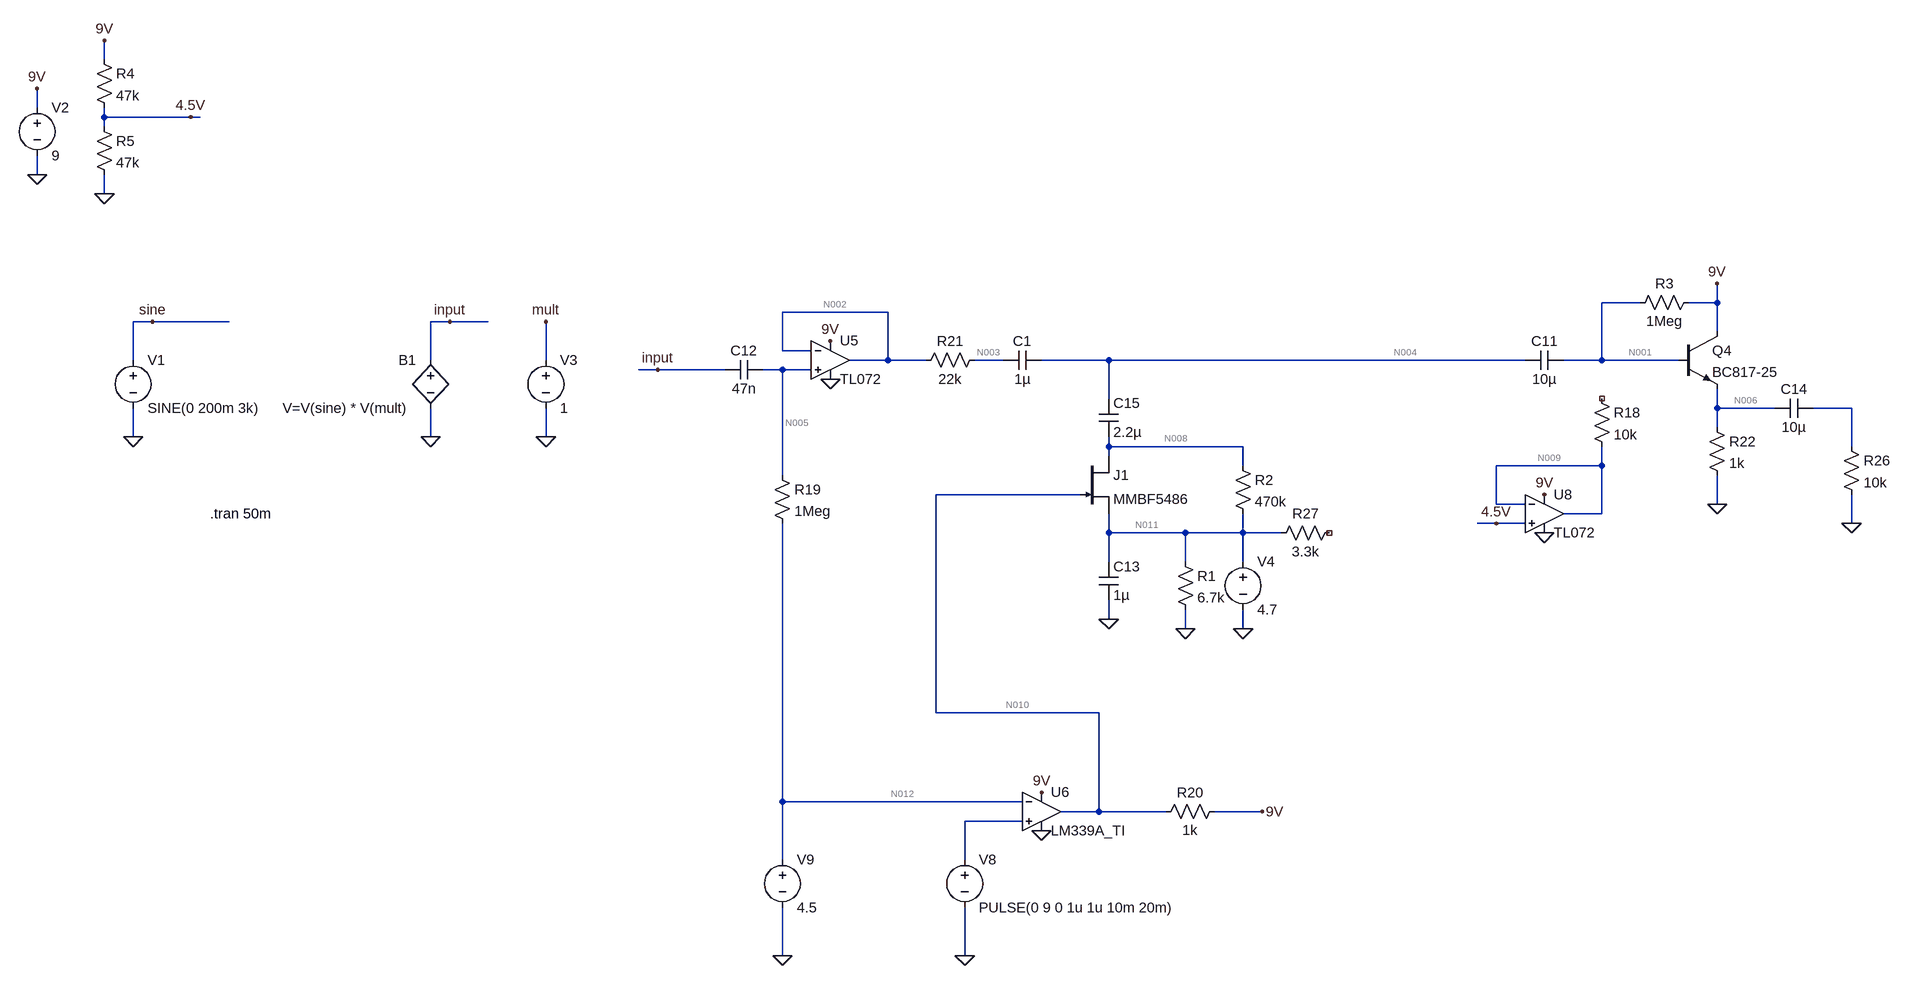
[diagram p0: schematic JFET_based_off.asc]
* JFET_based_off.asc
V1 sine 0 SINE(0 200m 3k)
V2 9V 0 9
R4 9V 4.5V 47k
R5 4.5V 0 47k
V3 mult 0 1
B1 input 0 V=V(sine) * V(mult)
* U5: TL072 (symbol ZZZ\OpAmp\TL072 not available, pins judged from their places): In+=N005 In-=N002 V+=9V V-=0 OUT=N002
C11 N001 N004 10µ
R18 NC_01 N009 10k
R19 N005 N012 1Meg
C12 N005 input 47n
V8 N013 0 PULSE(0 9 0 1u 1u 10m 20m)
V9 N012 0 4.5
* U6: LM339A_TI (symbol ZZZ\Comparator\LM339A_TI not available, pins judged from their places): In+=N013 In-=N012 V+=9V V-=0 OUT=N010
* U8: TL072 (symbol ZZZ\OpAmp\TL072 not available, pins judged from their places): In+=4.5V In-=N009 V+=9V V-=0 OUT=N009
Q4 9V N001 N006 0 BC817-25
R22 N006 0 1k
C14 N007 N006 10µ
R26 N007 0 10k
J1 N008 N010 N011 MMBF5486
R20 N010 9V 1k
R21 N003 N002 22k
C15 N004 N008 2.2µ
C13 N011 0 1µ
R27 NC_02 N011 3.3k
C1 N004 N003 1µ
V4 N011 0 4.7
R1 N011 0 6.7k
R2 N008 N011 470k
R3 9V N001 1Meg
.model NPN NPN
.model PNP PNP
.lib standard.bjt
.model NJF NJF
.model PJF PJF
.lib standard.jft
.tran 50m
.backanno
.end

* Results of the author's LTspice run, read from the files saved beside the schematic
* Operating Point, zero values left out:
*   V(9v) = 9 V
*   V(4.5v) = 4.5 V
*   V(mult) = 1 V
*   V(n002) = 4.5 V
*   V(n005) = 4.5 V
*   V(n001) = 2.789 V
*   V(n004) = 42.73 µV
*   V(n009) = 4.5 V
*   V(n012) = 4.5 V
*   V(n010) = 117.6 mV
*   V(n006) = 2.17 V
*   V(n008) = 4.7 V
*   V(n011) = 4.7 V
*   V(n003) = 4.5 V
*   Ic(Q4) = 2.164 mA
*   Ib(Q4) = 6.211 µA
*   Ie(Q4) = -2.17 mA
*   Id(J1) = 4.592 pA
*   Ig(J1) = -9.185 pA
*   Is(J1) = 4.592 pA
*   I(R3) = 6.211 µA
*   I(R2) = -4.593 pA
*   I(R1) = 701.5 µA
*   I(R20) = -8.882 mA
*   I(R22) = 2.17 mA
*   I(R19) = -34.55 pA
*   I(R5) = 95.74 µA
*   I(R4) = 95.74 µA
*   I(V4) = -701.5 µA
*   I(V9) = -43.42 pA
*   I(V8) = 49.98 nA
*   I(V2) = -20.13 mA
*   Ix(u5:1) = 34.55 pA
*   Ix(u5:2) = 34.55 pA
*   Ix(u5:3) = 4.395 mA
*   Ix(u5:4) = -4.395 mA
*   Ix(u5:5) = -34.55 pA
*   Ix(u6:1) = -49.98 nA
*   Ix(u6:2) = 8.863 pA
*   Ix(u6:3) = 194.4 µA
*   Ix(u6:4) = -9.077 mA
*   Ix(u6:5) = 8.882 mA
*   Ix(u8:1) = 34.55 pA
*   Ix(u8:2) = 34.55 pA
*   Ix(u8:3) = 4.395 mA
*   Ix(u8:4) = -4.395 mA
*   Ix(u8:5) = -34.55 pA
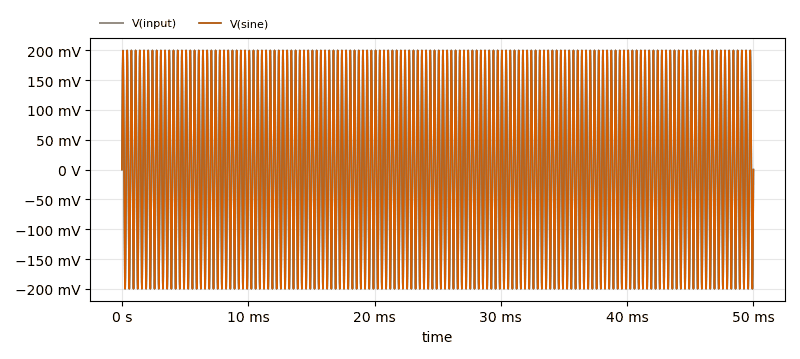
[diagram p1: Transient Analysis of JFET_based_off.asc, plotted from the saved traces]
* Transient Analysis, 1 run:
*   V(input): min -199.9 mV, max 200 mV, average -4.019 µV, rms 143.7 mV, last 0 V
*   V(sine): min -199.9 mV, max 200 mV, average -4.019 µV, rms 143.7 mV, last 0 V